# EAGLE design Coleco Cart V4 (EAGLE 7.7.0)
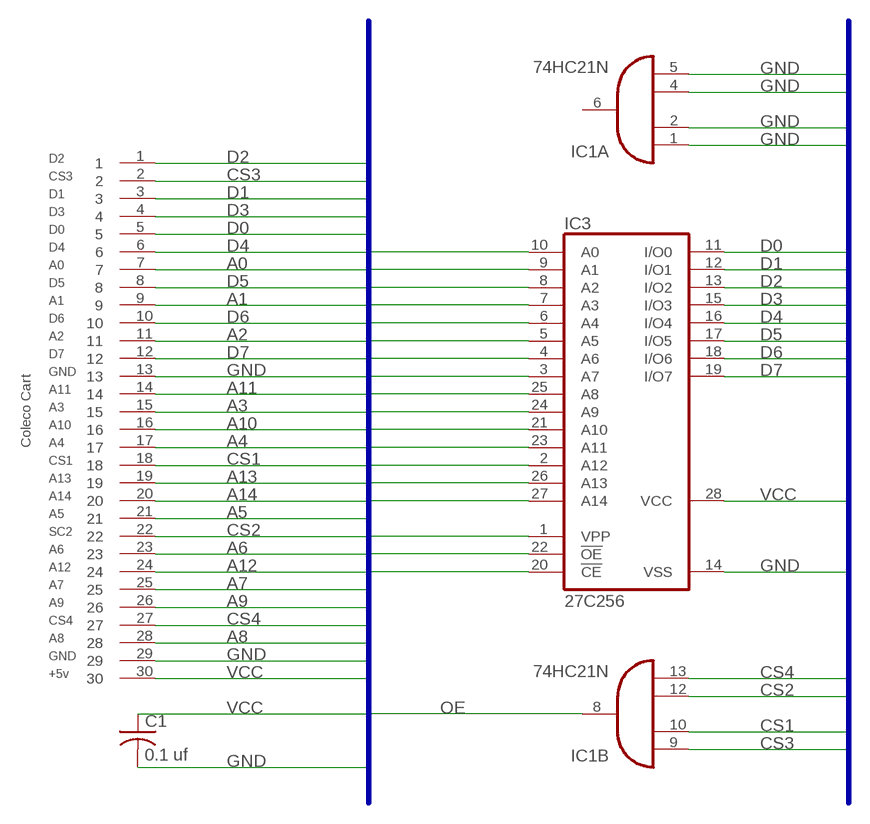
[diagram p0: schematic, sheet 1]

## Parts
C1  0.1 uf  C-US050-030X075  [C050-030X075]
IC1  74HC21N  [DIL14]
IC3  27C256  27C256AG  [DIL28-6]
U$1  CART  [CART]

## Nets
A0: IC3.10(A0) U$1.7
A1: IC3.9(A1) U$1.9
A2: IC3.8(A2) U$1.11
A3: IC3.7(A3) U$1.15
A4: IC3.6(A4) U$1.17
A5: IC3.5(A5) U$1.21
A6: IC3.4(A6) U$1.23
A7: IC3.3(A7) U$1.25
A8: IC3.25(A8) U$1.28
A9: IC3.24(A9) U$1.26
A10: IC3.21(A10) U$1.16
A11: IC3.23(A11) U$1.14
A12: IC3.2(A12) U$1.24
A13: IC3.26(A13) U$1.19
A14: IC3.27(A14) U$1.20
CS1: IC1.10(B:I1) U$1.18
CS2: IC1.12(B:I2) U$1.22
CS3: IC1.9(B:I0) U$1.2
CS4: IC1.13(B:I3) U$1.27
D0: IC3.11(I/O0) U$1.5
D1: IC3.12(I/O1) U$1.3
D2: IC3.13(I/O2) U$1.1
D3: IC3.15(I/O3) U$1.4
D4: IC3.16(I/O4) U$1.6
D5: IC3.17(I/O5) U$1.8
D6: IC3.18(I/O6) U$1.10
D7: IC3.19(I/O7) U$1.12
GND: C1.2 IC1.1(A:I0) IC1.2(A:I1) IC1.4(A:I2) IC1.5(A:I3) IC3.14(VSS) U$1.13 U$1.29
OE: IC1.8(B:O) IC3.20(!CE) IC3.22(!OE)
VCC: C1.1 IC3.1(VPP) IC3.28(VCC) U$1.30
Unconnected: IC1.6(A:O)

## Buses
VCC,GND,CS[1..4],A[0..14],D[0..7]
VCC,GND,OE,CS[1..4],A[0..14],D[0..7]

## Power pins joined to a net without a drawn wire
GND: IC1.7(P:GND)
VCC: IC1.14(P:VCC)

## Library data of the parts
C1 = rcl:C-US: CAPACITOR, American symbol
IC1 = 74xx-eu:74*21: Dual 4-input AND gate
IC3 = memory-hitachi:27C256AG: MEMORY; OC_FARNELL: unknown; OC_NEWARK: unknown
U$1 = ADAM:CART: Colecovision Card Designed for 8Bit Milli By That Old Nerd

## Board
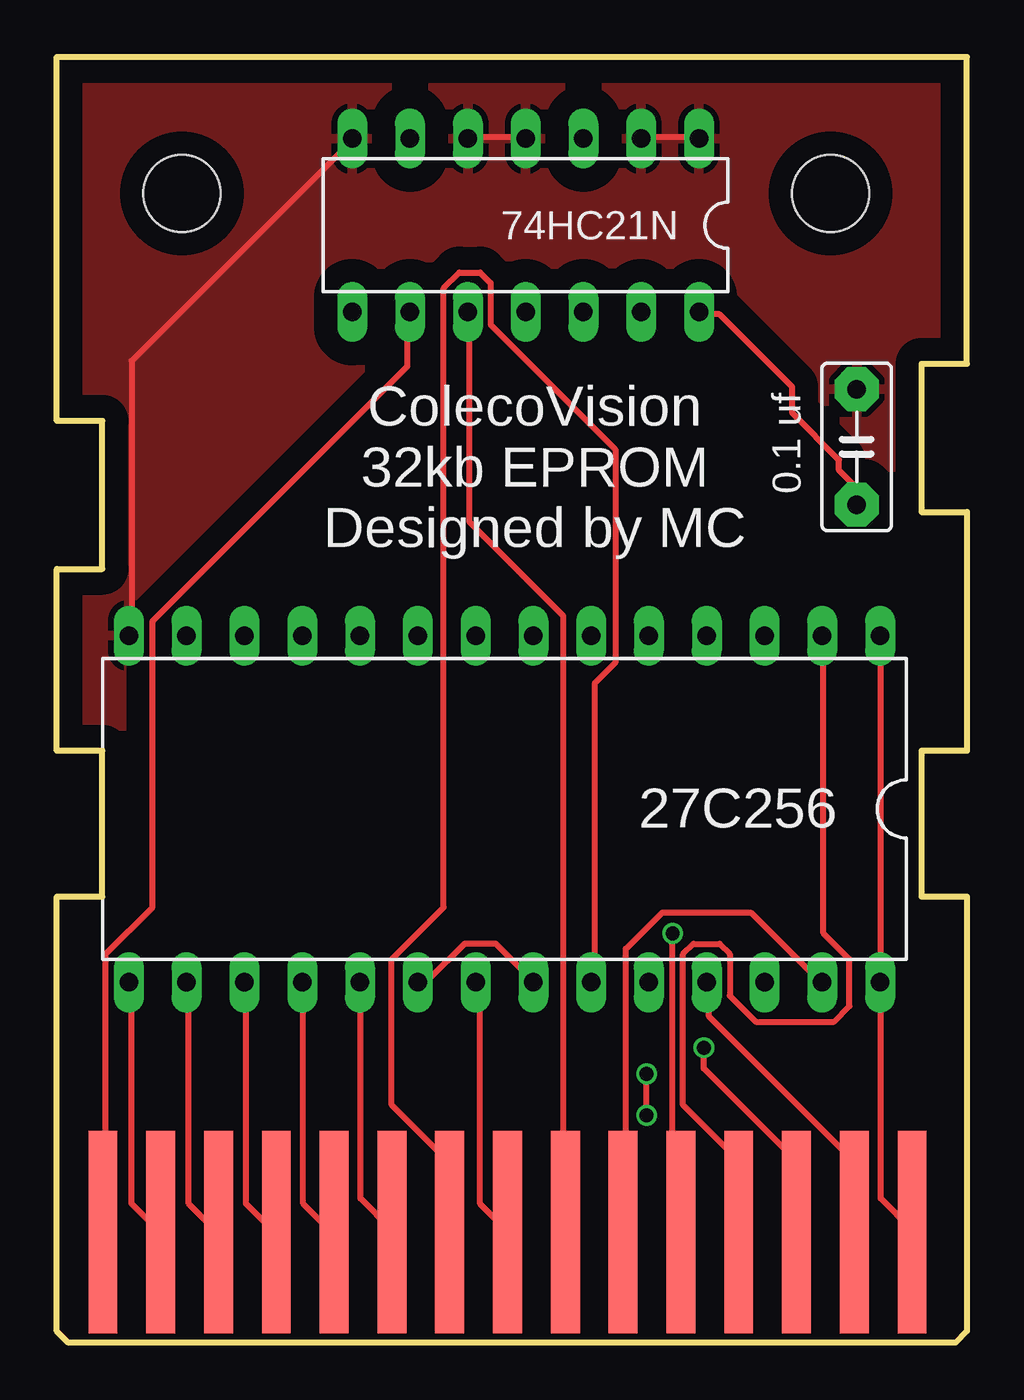
[diagram p1: board, top side]
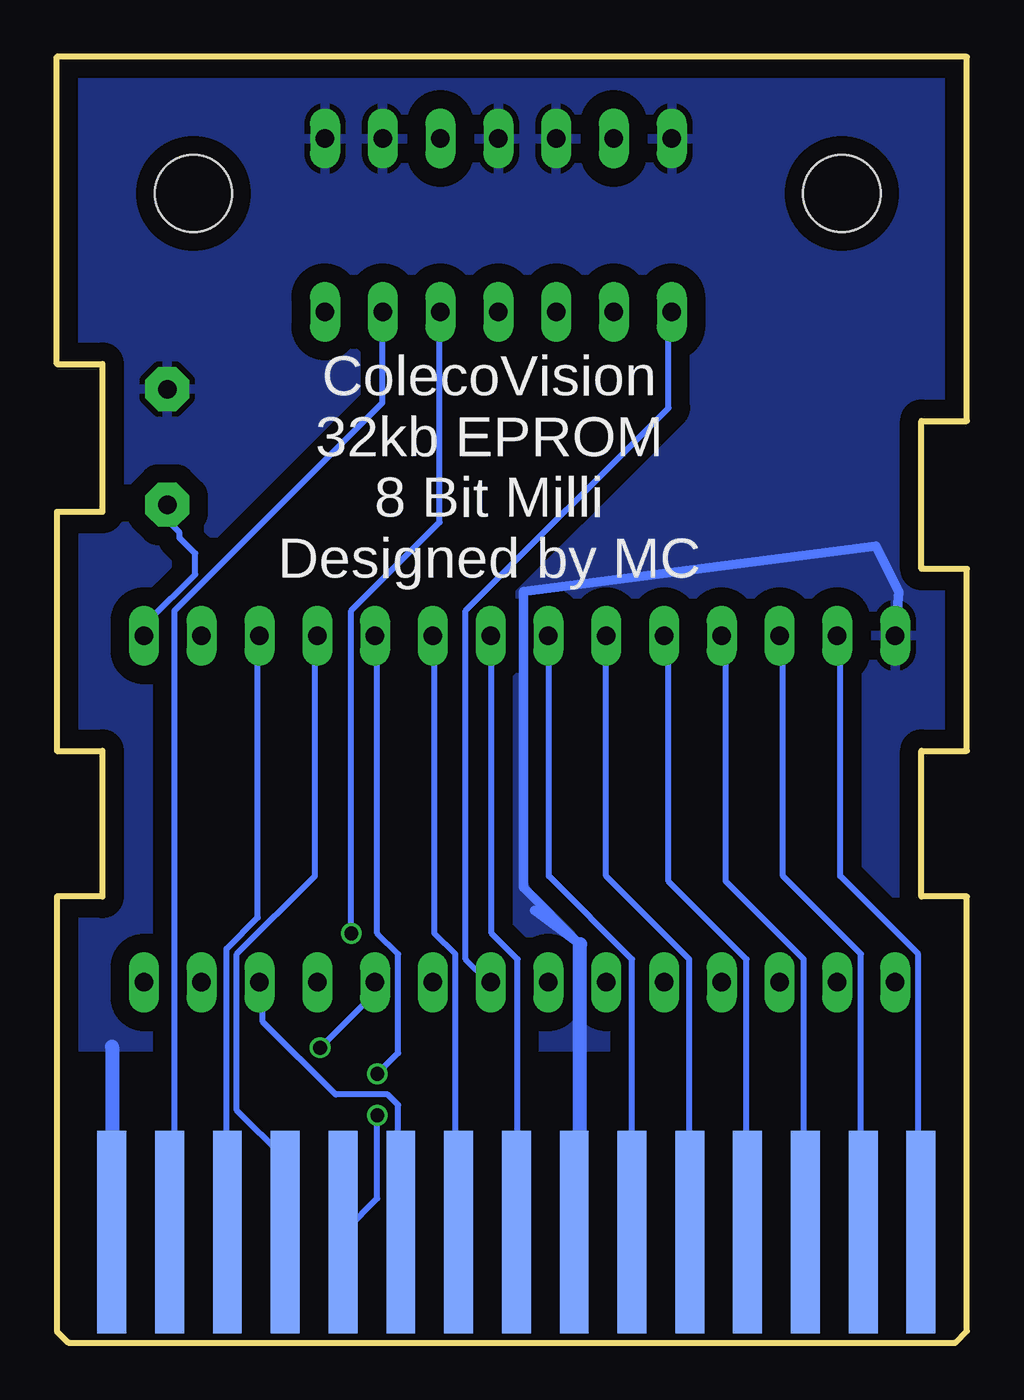
[diagram p2: board, bottom side, seen from below]

Size 40 x 56.5 mm. Coordinates in mm from the lower left corner, seen from the top.
Outline: 0,0.5 0,19.6 2,19.6 2,26 0,26 0,34 2,34 2,40.5 0,40.5 0,56.5 40,56.5 40,43 38,43 38,36.5 40,36.5 40,26 38,26 38,19.6 40,19.6 40,0.5 39.5,0 0.5,0 0,0.5
Copper layers (1*16): Top 0.035mm / dielectric 1.5mm / Bottom 0.035mm
Design rules "SeeedStudio_2layer_DRU_no_angle_20140221": minimum track width 6mil, minimum drill 12mil, track to track 6mil, track to pad 6mil, pad to pad 6mil, via to via 6mil, smd to smd 0mil, copper to edge 10mil, drill to drill 10mil, minimum pad ring 10mil, minimum via ring 6mil, stop-mask expansion 2mil, vias tented up to drill 100mil, thermal gap 10mil
Holes 3.4 mm at 5.5,50.5 34,50.5

### Footprints (pad centres in the part's own frame; a part is rotated, then mirrored left to right if it is on the bottom)
C050-030X075 = drill 0.813 pad 1.93 octagon: 1 -2.54,0; 2 2.54,0
DIL14 = drill 0.813 long: 1 -7.62,-3.81; 2 -5.08,-3.81; 3 -2.54,-3.81; 4 0,-3.81; 5 2.54,-3.81; 6 5.08,-3.81; 7 7.62,-3.81; 8 7.62,3.81; 9 5.08,3.81; 10 2.54,3.81; 11 0,3.81; 12 -2.54,3.81; 13 -5.08,3.81; 14 -7.62,3.81
DIL28-6 = drill 0.813 long: 1 -16.51,-7.62; 2 -13.97,-7.62; 3 -11.43,-7.62; 4 -8.89,-7.62; 5 -6.35,-7.62; 6 -3.81,-7.62; 7 -1.27,-7.62; 8 1.27,-7.62; 9 3.81,-7.62; 10 6.35,-7.62; 11 8.89,-7.62; 12 11.43,-7.62; 13 13.97,-7.62; 14 16.51,-7.62; 15 16.51,7.62; 16 13.97,7.62; 17 11.43,7.62; 18 8.89,7.62; 19 6.35,7.62; 20 3.81,7.62; 21 1.27,7.62; 22 -1.27,7.62; 23 -3.81,7.62; 24 -6.35,7.62; 25 -8.89,7.62; 26 -11.43,7.62; 27 -13.97,7.62; 28 -16.51,7.62
CART = smd 1.27 x 8.89 bottom: 1 -17.645,-24.655; 3 -15.105,-24.655; 5 -12.565,-24.655; 7 -10.025,-24.655; 9 -7.485,-24.655; 11 -4.945,-24.655; 13 -2.405,-24.655; 15 0.135,-24.655; 17 2.675,-24.655; 19 5.215,-24.655; 21 7.755,-24.655; 23 10.295,-24.655; 25 12.835,-24.655; 27 15.375,-24.655; 29 17.915,-24.655 | smd 1.27 x 8.89: 2 -17.645,-24.655; 4 -15.105,-24.655; 6 -12.565,-24.655; 8 -10.025,-24.655; 10 -7.485,-24.655; 12 -4.945,-24.655; 14 -2.405,-24.655; 16 0.135,-24.655; 18 2.675,-24.655; 20 5.215,-24.655; 22 7.755,-24.655; 24 10.295,-24.655; 26 12.835,-24.655; 28 15.375,-24.655; 30 17.915,-24.655

### Placement (x,y rotation side)
C1  35.15,39.36 90 top
IC1  20.6,49.1 180 top
IC3  19.67,23.45 180 top
U$1  19.67,29.52 0 top

### Tracks (layer width: path | path; a pad name or v marks a point on that pad's centre or on a via)
A0
  Bottom 0.254: IC3.10 13.12,31.02 13.12,20.27 9.69,16.84 9.69,4.96 U$1.7
A1
  Bottom 0.254: IC3.9 15.86,20.5 12.2,16.84 12.2,4.96 U$1.9
A2
  Bottom 0.254: IC3.8 18.38,31.02 18.38,20.5 14.72,16.84 14.72,4.96 U$1.11
A3
  Bottom 0.254: IC3.7 20.89,31.02 20.89,17.99 19.75,16.84 19.75,4.96 U$1.15
A4
  Bottom 0.254: IC3.6 23.4,31.02 23.4,17.99 22.49,17.07 22.49,4.96 U$1.17
A5  (via drill 0.61)
  Top 0.254: v25.92,9.99 v25.92,11.82
  Bottom 0.254: v25.92,11.82 25,12.73 25,17.07 25.92,17.99 25.92,31.02 IC3.5 | v25.92,9.99 25.92,6.33 27.29,4.96 U$1.21
A6
  Bottom 0.254: IC3.4 28.66,31.02 28.66,20.5 32.09,17.07 32.09,10.22 30.03,8.16 30.03,4.96 U$1.23
A7
  Bottom 0.254: IC3.3 31.18,31.02 31.18,18.67 32.55,17.3 32.55,4.96 U$1.25
A8
  Top 0.254: IC3.25 28.66,15.7 28.66,14.33 34.83,8.16 34.83,4.96 U$1.28
A9  (via drill 0.61)
  Top 0.254: v28.43,12.96 28.43,12.04 32.32,8.16 32.32,4.96 U$1.26
  Bottom 0.254: v28.43,12.96 26.15,15.24 26.15,15.7 IC3.24
A10
  Top 0.254: IC3.21 18.6,15.7 18.6,6.1 19.75,4.96 U$1.16
A11
  Top 0.254: IC3.23 23.63,15.93 23.63,28.96 24.55,29.88 24.55,39.25 19.06,44.73 19.06,46.56 18.6,47.02 17.69,47.02 17,46.34 17,19.13 14.72,16.84 14.72,10.45 17.23,7.93 17.23,4.96 U$1.14
A12
  Top 0.254: IC3.2 33.69,31.02 33.69,17.99 34.83,16.84 34.83,14.79 34.15,14.1 30.72,14.1 29.58,15.24 29.58,17.07 29.12,17.53 27.98,17.53 27.52,17.07 27.52,10.45 29.8,8.16 29.8,4.96 U$1.24
A13
  Bottom 0.254: IC3.26 30.95,15.7 30.95,14.1 27.75,10.9 25.46,10.9 25,10.45 25,4.96 U$1.19
A14
  Top 0.254: IC3.27 33.46,15.93 30.49,18.9 26.6,18.9 25,17.3 25,4.96 U$1.20
CS1
  Top 0.254: IC1.10 18.15,45.19 18.15,36.05 22.26,31.93 22.26,4.96 U$1.18
CS2  (via drill 0.61)
  Top 0.254: v27.06,17.99 27.06,5.19 27.29,4.96 U$1.22
  Bottom 0.254: v27.06,17.99 27.06,32.16 23.18,36.05 23.18,45.19 IC1.12
CS3
  Top 0.254: IC1.9 15.4,45.19 15.4,42.91 4.2,31.7 4.2,19.13 2.14,17.07 2.14,4.96 U$1.2
CS4
  Bottom 0.254: IC1.13 25.69,45.19 25.69,41.31 34.83,32.16 34.83,4.96 U$1.27
D0
  Bottom 0.254: IC3.11 10.6,31.02 10.6,20.27 7.17,16.84 7.17,4.96 U$1.5
D1
  Bottom 0.254: IC3.12 8.09,31.02 8.09,20.5 4.66,17.07 4.66,4.96 U$1.3
D2
  Bottom 0.254: IC3.13 5.57,31.02 5.57,20.5 2.14,17.07 2.14,4.96 U$1.1
D3
  Top 0.254: IC3.15 3.29,15.7 3.29,6.1 4.43,4.96 U$1.4
D4
  Top 0.254: IC3.16 5.8,15.7 5.8,6.1 6.95,4.96 U$1.6
D5
  Top 0.254: IC3.17 8.32,15.7 8.32,6.1 9.46,4.96 U$1.8
D6
  Top 0.254: IC3.18 10.83,15.7 10.83,6.1 11.97,4.96 U$1.10
D7
  Top 0.254: IC3.19 13.35,15.7 13.35,6.33 14.72,4.96 U$1.12
GND
  Top 0.254: IC1.2 25.69,52.96 28.2,52.96 IC1.1 | IC1.5 18.15,52.96 20.43,52.96 IC1.4 | IC3.14 3.29,31.25 3.29,43.13 12.89,52.74 IC1.7
  Bottom 0.254: 37.58,4.96 U$1.29
  Bottom 0.406: U$1.13 17,4.87 | 19,19 17,17.5 19.5,20 19.5,33 4,35 3,33 IC3.14
  Bottom 0.61: 37.58,13 37.58,4.96 | 17,4.87 17,17.5
  pour Top (isolate 1.016): 40,13 0,13 0,19.5 2,19.5 2,26 0,26 0,34 2,34 2,40.5 0,40.5 0,56.5 40,56.5 40,43 38,43 38,36.5 40,36.5 40,26 38,26 38,19.5 40,19.5
  pour Bottom (isolate 0.813): 40,13 0,13 0,19.5 2,19.5 2,26 0,26 0,34 2,34 2,40.5 0,40.5 0,56.5 40,56.5 40,43 38,43 38,36.5 40,36.5 40,36 40,26 38,26 38,19.5 40,19.5
OE
  Top 0.254: IC3.20 15.86,15.93 16.32,15.93 17.92,17.53 19.29,17.53 20.89,15.93 IC3.22
  Bottom 0.254: IC1.8 13.12,45.19 13.12,41.08 22.03,32.16 22.03,16.84 21.12,15.93 IC3.22
VCC
  Top 0.254: U$1.30 37.58,4.96 36.2,6.33 36.2,15.7 IC3.28 36.2,15.93 36.2,31.02 IC3.1 | IC1.14 28.43,45.19 29.12,45.19 32.32,41.99 32.32,40.85 34.38,38.79 34.38,38.33 35.29,37.42 35.29,36.96 C1.1
  Bottom 0.254: C1.1 35.06,36.73 35.06,36.05 34.6,35.59 34.6,35.36 33.92,34.68 33.92,33.76 35.98,31.7 35.98,31.25 IC3.1

### Text on the board
tPlace: ColecoVision / 32kb EPROM / Designed by MC
bPlace: ColecoVision / 32kb EPROM / 8 Bit Milli / Designed by MC